# Altium schematic sheet pwmdisplay.SchDoc
size A4
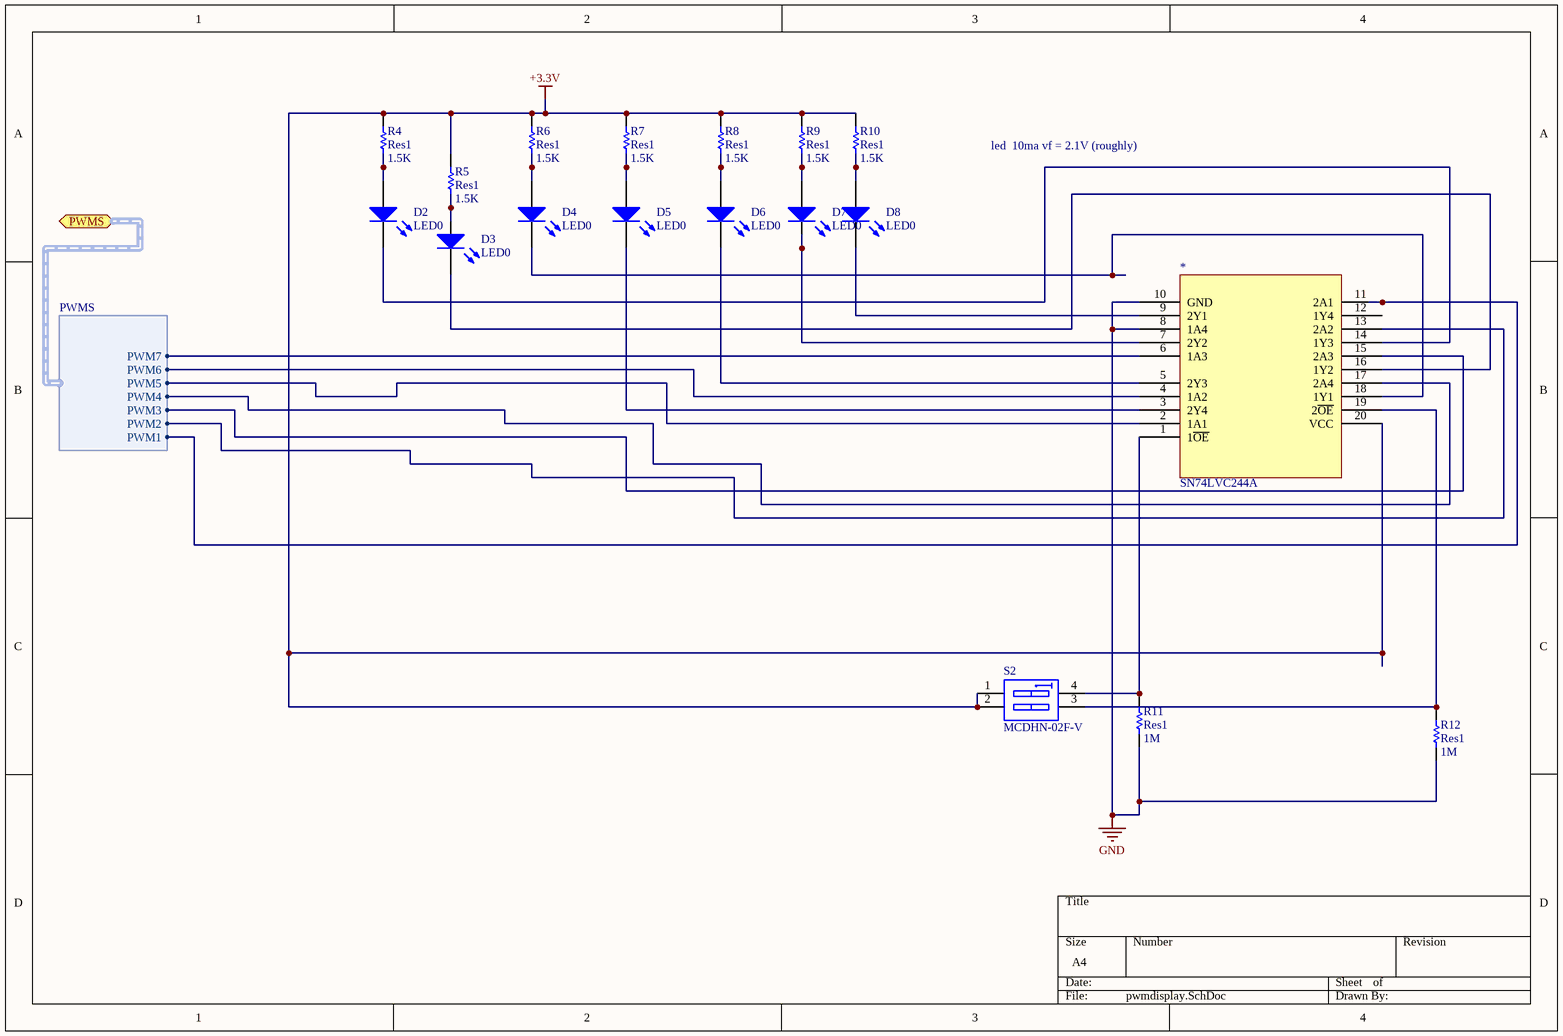
[diagram p0: pwmdisplay.SchDoc]

## Parts
*  SN74LVC244A  [DW (R-PDS0-G20)]
D2  LED0  [LGQ971]
D3  LED0  [LGQ971]
D4  LED0  [LGQ971]
D5  LED0  [LGQ971]
D6  LED0  [LGQ971]
D7  LED0  [LGQ971]
D8  LED0  [LGQ971]
R4  Res1  value 1.5K  [AXIAL-0.3]
R5  Res1  value 1.5K  [AXIAL-0.3]
R6  Res1  value 1.5K  [AXIAL-0.3]
R7  Res1  value 1.5K  [AXIAL-0.3]
R8  Res1  value 1.5K  [AXIAL-0.3]
R9  Res1  value 1.5K  [AXIAL-0.3]
R10  Res1  value 1.5K  [AXIAL-0.3]
R11  Res1  value 1M  [AXIAL-0.3]
R12  Res1  value 1M  [AXIAL-0.3]
S2  MCDHN-02F-V  [MCDHN-02F-V]

## Ports
PWMS (harness PWMS)

## Harnesses
PWMS: PWM1, PWM2, PWM3, PWM4, PWM5, PWM6, PWM7

## Nets
+3.3V: *.20(VCC) R4.2 R5.2 R6.2 R7.2 R8.2 R9.2 R10.2 S2.1(A1) S2.2(A2)
GND: *.8(1A4) *.10(GND) R11.1 R12.1
Net*_1: *.1(1~{OE}) R11.2 S2.4(B1)
Net*_2: *.2(1A1) ; port PWMS.PWM5
Net*_3: *.3(2Y4) D5.2(K)
Net*_4: *.4(1A2) ; port PWMS.PWM6
Net*_5: *.5(2Y3) D6.2(K)
Net*_6: *.6(1A3) ; port PWMS.PWM7
Net*_7: *.7(2Y2) D7.2(K)
Net*_9: *.9(2Y1) D8.2(K)
Net*_11: *.11(2A1) ; port PWMS.PWM1
Net*_13: *.13(2A2) ; port PWMS.PWM2
Net*_14: *.14(1Y3) D2.2(K)
Net*_15: *.15(2A3) ; port PWMS.PWM3
Net*_16: *.16(1Y2) D3.2(K)
Net*_17: *.17(2A4) ; port PWMS.PWM4
Net*_18: *.18(1Y1) D4.2(K)
Net*_19: *.19(2~{OE}) R12.2 S2.3(B2)
NetD2_1: D2.1(A) R4.1
NetD3_1: D3.1(A) R5.1
NetD4_1: D4.1(A) R6.1
NetD5_1: D5.1(A) R7.1
NetD6_1: D6.1(A) R8.1
NetD7_1: D7.1(A) R9.1
NetD8_1: D8.1(A) R10.1

Not connected (* = marked no-connect by the designer): * 12(1Y4)

## Notes on the sheet
- led  10ma vf = 2.1V (roughly)

## Library data of the parts
D2-D8 = LED0: Typical INFRARED GaAs LED; Published: 8-Jun-2000; LatestRevisionDate: 08-Jul-2005; LatestRevisionNote: Mech Layer 1 removed.; PackageReference: LED-0; Publisher: Altium Limited; PackageDescription: LED; 2 Leads
R4-R12 = Res1: Resistor; Published: 8-Jun-2000; LatestRevisionDate: 17-Jul-2002; LatestRevisionNote: Re-released for DXP Platform.; PackageReference: AXIAL-0.3; Publisher: Altium Limited; PackageDescription: Axial Device, Thru-Hole; 2 Leads; 0.3 in Pin Spacing
S2 = SW DIP-2: DIP Switch, 2 Position, SPST; Published: 24-Mar-1999; LatestRevisionDate: 17-Jul-2002; LatestRevisionNote: Re-released for DXP Platform.; PackageReference: DIP-4; Publisher: Altium Limited